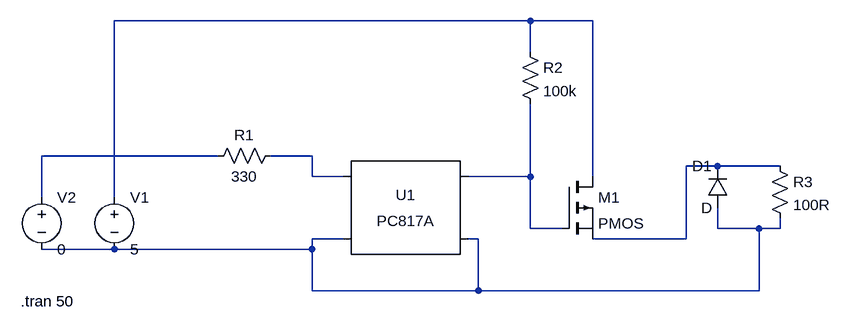
[diagram p0: schematic Schaltung_neu.asc]
Schaltung_neu.asc, the LTspice schematic file:
Version 4.1
SHEET 1 1084 680
WIRE 624 -128 -16 -128
WIRE 720 -128 624 -128
WIRE 624 -80 624 -128
WIRE 144 80 -128 80
WIRE 288 80 224 80
WIRE 912 96 864 96
WIRE 1008 96 912 96
WIRE 288 112 288 80
WIRE 336 112 288 112
WIRE 624 112 624 0
WIRE 624 112 528 112
WIRE 720 112 720 -128
WIRE -128 144 -128 80
WIRE -16 144 -16 -128
WIRE 624 192 624 112
WIRE 672 192 624 192
WIRE 912 192 912 160
WIRE 976 192 912 192
WIRE 1008 192 1008 176
WIRE 1008 192 976 192
WIRE 336 208 288 208
WIRE 544 208 528 208
WIRE 864 208 864 96
WIRE 864 208 720 208
WIRE -16 224 -128 224
WIRE 288 224 288 208
WIRE 288 224 -16 224
WIRE 288 288 288 224
WIRE 544 288 544 208
WIRE 544 288 288 288
WIRE 976 288 976 192
WIRE 976 288 544 288
SYMBOL voltage -16 128 R0
WINDOW 123 0 0 Left 0
WINDOW 39 0 0 Left 0
SYMATTR InstName V1
SYMATTR Value 5
SYMBOL voltage -128 128 R0
WINDOW 123 0 0 Left 0
WINDOW 39 0 0 Left 0
SYMATTR InstName V2
SYMATTR Value 0
SYMBOL res 240 64 R90
WINDOW 0 0 56 VBottom 2
WINDOW 3 32 56 VTop 2
SYMATTR InstName R1
SYMATTR Value 330
SYMBOL Optos\\PC817A 432 160 R0
SYMATTR InstName U1
SYMBOL pmos 672 112 R0
SYMATTR InstName M1
SYMBOL res 608 -96 R0
SYMATTR InstName R2
SYMATTR Value 100k
SYMBOL res 992 80 R0
SYMATTR InstName R3
SYMATTR Value 100R
SYMBOL diode 928 160 R180
WINDOW 0 24 64 Left 2
WINDOW 3 24 0 Left 2
SYMATTR InstName D1
TEXT -160 304 Left 2 !.tran 50

The netlist it stands for:
* Schaltung_neu.asc
V1 N001 N006 5
V2 N002 N006 0
R1 N003 N002 330
X§U1 N003 N006 N005 N006 PC817 Igain=1m
M1 N001 N005 N004 N004 PMOS
R2 N001 N005 100k
R3 N004 N006 100R
D1 N006 N004 D
.model D D
.lib standard.dio
.model NMOS NMOS
.model PMOS PMOS
.lib standard.mos
.tran 50
.lib PC817.sub
.backanno
.end